# EAGLE design Pure Keys aec-pcb3-smd-inProgress (EAGLE 9.1.1)

## Sheet 1 of 7: ATMEGA328P
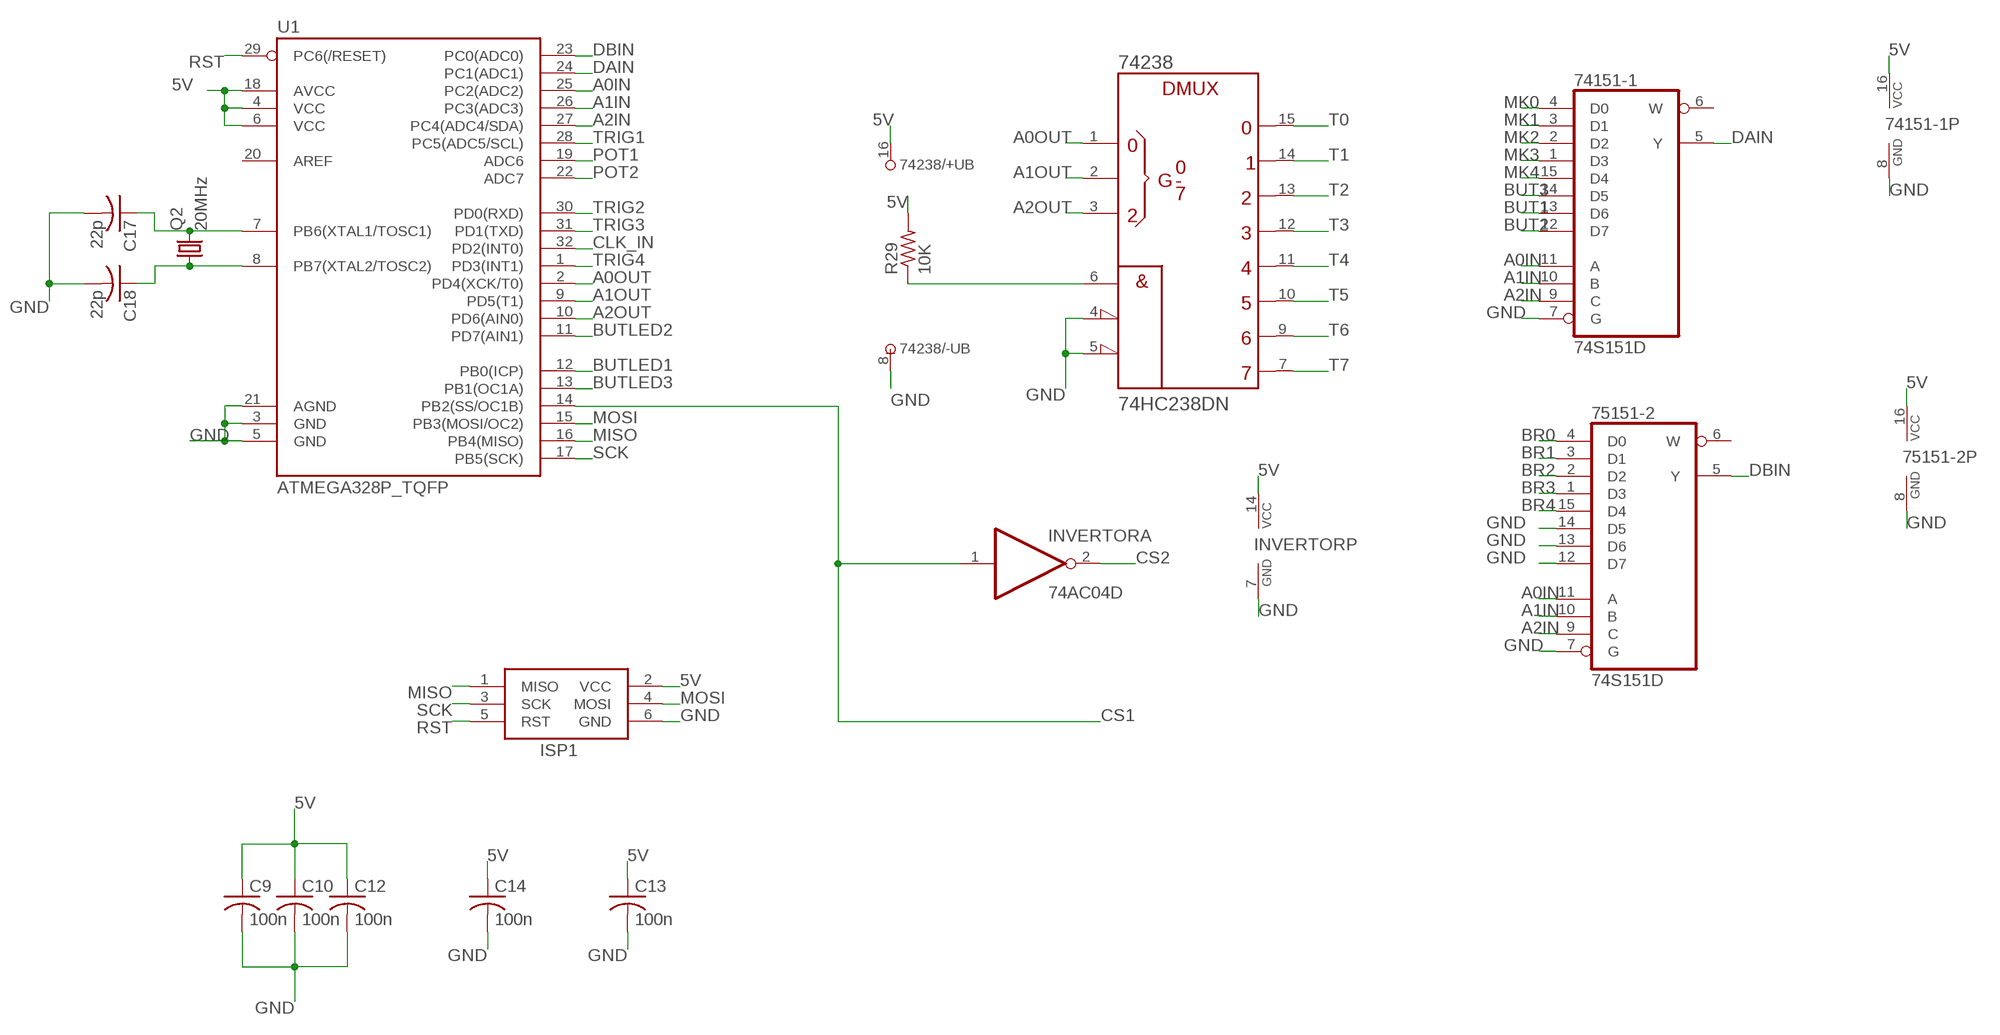
[diagram p0: schematic, sheet 1]

### Parts
74151-1  74S151D  [SO16]
74238  74HC238DN  [SO16]
75151-2  74S151D  [SO16]
C9  100n  C-USC0805K  [C0805K]
C10  100n  C-USC0805K  [C0805K]
C12  100n  C-USC0805K  [C0805K]
C13  100n  C-USC0805K  [C0805K]
C14  100n  C-USC0805K  [C0805K]
C17  22p  C-USC0805K  [C0805K]
C18  22p  C-USC0805K  [C0805K]
INVERTOR  74AC04D  [SO14]
ISP1  AVRISP-6  [AVRISP]
Q2  20MHz  CRYSTALHC49UP  [HC49UP]
R29  10K  R-US_R0805  [R0805]
U1  ATMEGA328P_TQFP  [TQFP32-08]

### Nets
5V: 74151-1.16(VCC) 74238.16(+UB) 75151-2.16(VCC) C9.1 C10.1 C12.1 C13.1 C14.1 INVERTOR.14(P:VCC) ISP1.2(VCC) R29.2 U1.4(VCC) U1.6(VCC) U1.18(AVCC) ; also sheet 2,4,5,6,7
A0IN: 74151-1.11(A) 75151-2.11(A) U1.25(PC2(ADC2))
A0OUT: 74238.1(A) U1.2(PD4(XCK/T0))
A1IN: 74151-1.10(B) 75151-2.10(B) U1.26(PC3(ADC3))
A1OUT: 74238.2(B) U1.9(PD5(T1))
A2IN: 74151-1.9(C) 75151-2.9(C) U1.27(PC4(ADC4/SDA))
A2OUT: 74238.3(C) U1.10(PD6(AIN0))
BR0: 75151-2.4(D0) ; also sheet 3
BR1: 75151-2.3(D1) ; also sheet 3
BR2: 75151-2.2(D2) ; also sheet 3
BR3: 75151-2.1(D3) ; also sheet 3
BR4: 75151-2.15(D4) ; also sheet 3
BUT1: 74151-1.13(D6) ; also sheet 6
BUT2: 74151-1.12(D7) ; also sheet 6
BUT3: 74151-1.14(D5) ; also sheet 6
BUTLED1: U1.12(PB0(ICP)) ; also sheet 6
BUTLED2: U1.11(PD7(AIN1)) ; also sheet 6
BUTLED3: U1.13(PB1(OC1A)) ; also sheet 6
CLK_IN: U1.32(PD2(INT0)) ; also sheet 7
CS1: INVERTOR.1(A:I) U1.14(PB2(SS/OC1B)) ; also sheet 5
CS2: INVERTOR.2(A:O) ; also sheet 5
DAIN: 74151-1.5(Y) U1.24(PC1(ADC1))
DBIN: 75151-2.5(Y) U1.23(PC0(ADC0))
ENOUT1: 74238.6(G1) R29.1
GND: 74151-1.7(G) 74151-1.8(GND) 74238.4(!G2A) 74238.5(!G2B) 74238.8(-UB) 75151-2.7(G) 75151-2.8(GND) 75151-2.12(D7) 75151-2.13(D6) 75151-2.14(D5) C9.2 C10.2 C12.2 C13.2 C14.2 C17.2 C18.2 INVERTOR.7(P:GND) ISP1.6(GND) U1.3(GND) U1.5(GND) U1.21(AGND) ; also sheet 2,3,4,5,6,7
MISO: ISP1.1(MISO) U1.16(PB4(MISO))
MK0: 74151-1.4(D0) ; also sheet 3
MK1: 74151-1.3(D1) ; also sheet 3
MK2: 74151-1.2(D2) ; also sheet 3
MK3: 74151-1.1(D3) ; also sheet 3
MK4: 74151-1.15(D4) ; also sheet 3
MOSI: ISP1.4(MOSI) U1.15(PB3(MOSI/OC2)) ; also sheet 5
N$10: C17.1 Q2.2 U1.7(PB6(XTAL1/TOSC1))
N$11: C18.1 Q2.1 U1.8(PB7(XTAL2/TOSC2))
POT1: U1.19(ADC6) ; also sheet 6
POT2: U1.22(ADC7) ; also sheet 6
RST: ISP1.5(RST) U1.29(PC6(/RESET))
SCK: ISP1.3(SCK) U1.17(PB5(SCK)) ; also sheet 5
T0: 74238.15(Y0) ; also sheet 3
T1: 74238.14(Y1) ; also sheet 3
T2: 74238.13(Y2) ; also sheet 3
T3: 74238.12(Y3) ; also sheet 3
T4: 74238.11(Y4) ; also sheet 3
T5: 74238.10(Y5) ; also sheet 3
T6: 74238.9(Y6) ; also sheet 3
T7: 74238.7(Y7) ; also sheet 3
TRIG1: U1.28(PC5(ADC5/SCL)) ; also sheet 4
TRIG2: U1.30(PD0(RXD)) ; also sheet 4
TRIG3: U1.31(PD1(TXD)) ; also sheet 4
TRIG4: U1.1(PD3(INT1)) ; also sheet 4
Unconnected: 74151-1.6(W) 75151-2.6(W) INVERTOR.3(B:I) INVERTOR.4(B:O) INVERTOR.5(C:I) INVERTOR.6(C:O) INVERTOR.8(D:O) INVERTOR.9(D:I) INVERTOR.10(E:O) INVERTOR.11(E:I) INVERTOR.12(F:O) INVERTOR.13(F:I) U1.20(AREF)

## Sheet 2 of 7: Power
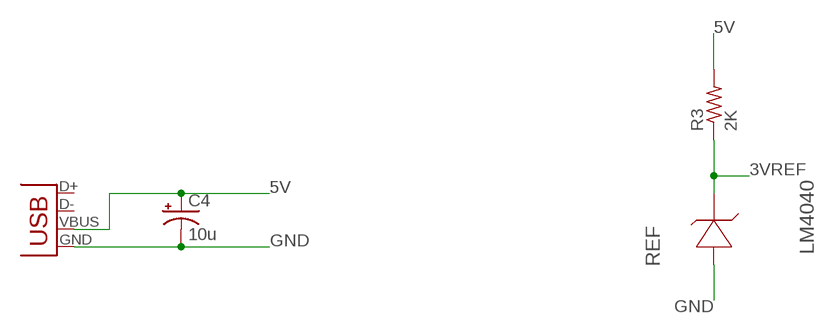
[diagram p1: schematic, sheet 2]

### Parts
C4  10u  CPOL-US153CLV-0505  [153CLV-0505]
JP2  USB-B  USBPTH  [USB-B-PTH]
R3  2K  R-US_R0805  [R0805]
REF  LM4040  LM4040A30IDBZT  [SOT95P237X112-3N]

### Nets
3VREF: R3.1 REF.1(CATHODE) ; also sheet 5
5V: C4.+ JP2.VBUS R3.2 ; also sheet 1,4,5,6,7
GND: C4.- JP2.GND REF.2(ANODE) ; also sheet 1,3,4,5,6,7
Unconnected: JP2.D+ JP2.D- REF.3(NC)

## Sheet 3 of 7: Keyboard Connector
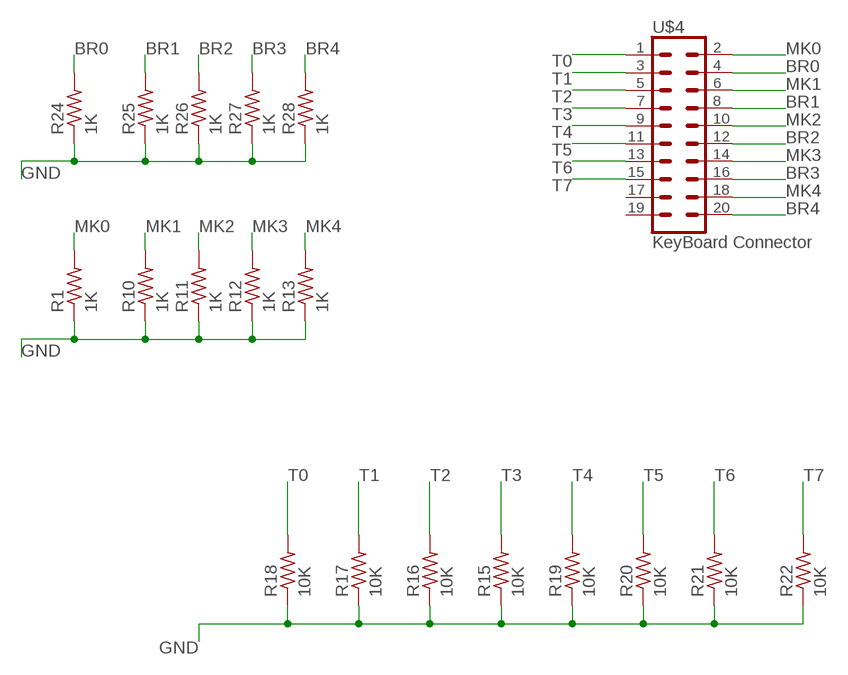
[diagram p2: schematic, sheet 3]

### Parts
R1  1K  R-US_R0805  [R0805]
R10  1K  R-US_R0805  [R0805]
R11  1K  R-US_R0805  [R0805]
R12  1K  R-US_R0805  [R0805]
R13  1K  R-US_R0805  [R0805]
R15  10K  R-US_R0805  [R0805]
R16  10K  R-US_R0805  [R0805]
R17  10K  R-US_R0805  [R0805]
R18  10K  R-US_R0805  [R0805]
R19  10K  R-US_R0805  [R0805]
R20  10K  R-US_R0805  [R0805]
R21  10K  R-US_R0805  [R0805]
R22  10K  R-US_R0805  [R0805]
R24  1K  R-US_R0805  [R0805]
R25  1K  R-US_R0805  [R0805]
R26  1K  R-US_R0805  [R0805]
R27  1K  R-US_R0805  [R0805]
R28  1K  R-US_R0805  [R0805]
U$4  KeyBoard Connector  CONN_10X2  [2X10]

### Nets
BR0: R24.2 U$4.4 ; also sheet 1
BR1: R25.2 U$4.8 ; also sheet 1
BR2: R26.2 U$4.12 ; also sheet 1
BR3: R27.2 U$4.16 ; also sheet 1
BR4: R28.2 U$4.20 ; also sheet 1
GND: R1.1 R10.1 R11.1 R12.1 R13.1 R15.1 R16.1 R17.1 R18.1 R19.1 R20.1 R21.1 R22.1 R24.1 R25.1 R26.1 R27.1 R28.1 ; also sheet 1,2,4,5,6,7
MK0: R1.2 U$4.2 ; also sheet 1
MK1: R10.2 U$4.6 ; also sheet 1
MK2: R11.2 U$4.10 ; also sheet 1
MK3: R12.2 U$4.14 ; also sheet 1
MK4: R13.2 U$4.18 ; also sheet 1
T0: R18.2 U$4.1 ; also sheet 1
T1: R17.2 U$4.3 ; also sheet 1
T2: R16.2 U$4.5 ; also sheet 1
T3: R15.2 U$4.7 ; also sheet 1
T4: R19.2 U$4.9 ; also sheet 1
T5: R20.2 U$4.11 ; also sheet 1
T6: R21.2 U$4.13 ; also sheet 1
T7: R22.2 U$4.15 ; also sheet 1
Unconnected: U$4.17 U$4.19

## Sheet 4 of 7: Triggers
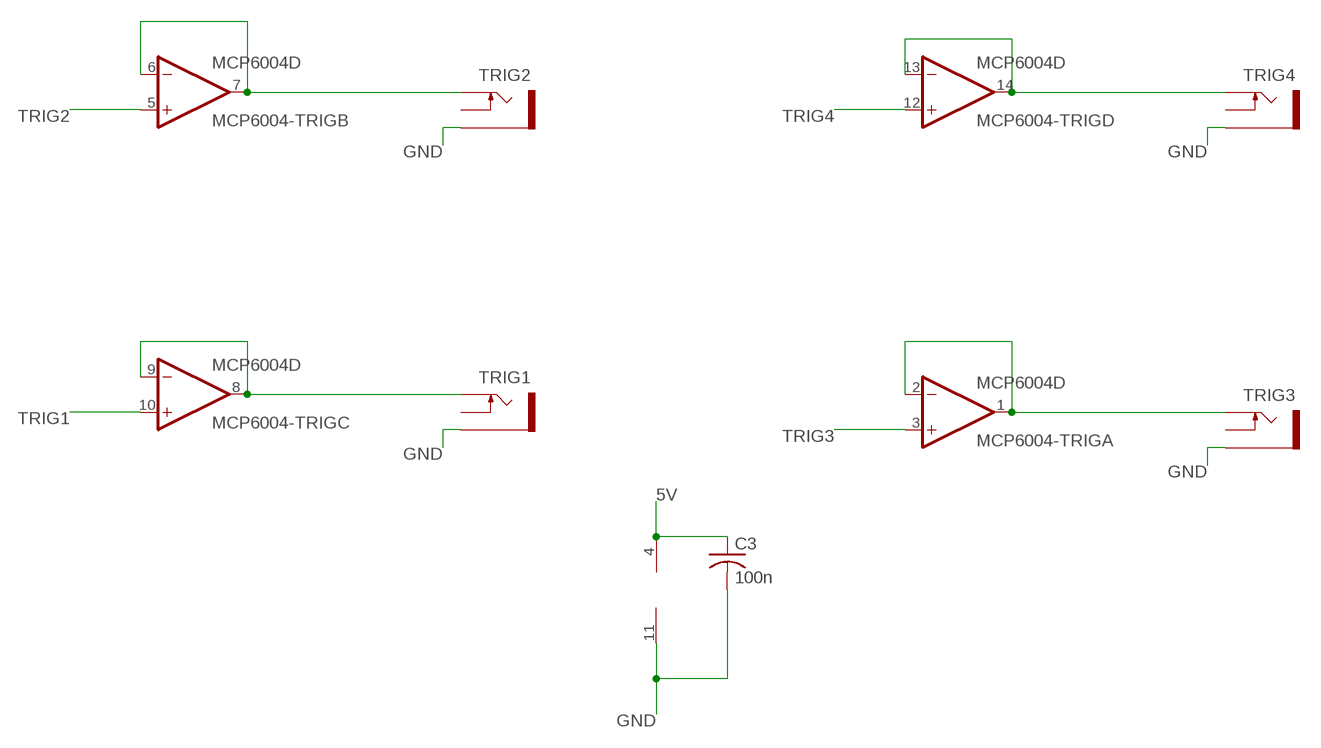
[diagram p3: schematic, sheet 4]

### Parts
C3  100n  C-USC0805K  [C0805K]
MCP6004-TRIG  MCP6004D  [SO14]
TRIG1  PJ302M  [PJ302M]
TRIG2  PJ302M  [PJ302M]
TRIG3  PJ302M  [PJ302M]
TRIG4  PJ302M  [PJ302M]

### Nets
5V: C3.1 MCP6004-TRIG.4(P:V+) ; also sheet 1,2,5,6,7
GND: C3.2 MCP6004-TRIG.11(P:V-) TRIG1.GND(SLEEVE) TRIG2.GND(SLEEVE) TRIG3.GND(SLEEVE) TRIG4.GND(SLEEVE) ; also sheet 1,2,3,5,6,7
N$3: MCP6004-TRIG.6(B:-IN) MCP6004-TRIG.7(B:OUT) TRIG2.TIP
N$4: MCP6004-TRIG.8(C:OUT) MCP6004-TRIG.9(C:-IN) TRIG1.TIP
N$5: MCP6004-TRIG.13(D:-IN) MCP6004-TRIG.14(D:OUT) TRIG4.TIP
N$6: MCP6004-TRIG.1(A:OUT) MCP6004-TRIG.2(A:-IN) TRIG3.TIP
TRIG1: MCP6004-TRIG.10(C:+IN) ; also sheet 1
TRIG2: MCP6004-TRIG.5(B:+IN) ; also sheet 1
TRIG3: MCP6004-TRIG.3(A:+IN) ; also sheet 1
TRIG4: MCP6004-TRIG.12(D:+IN) ; also sheet 1
Unconnected: TRIG1.SW(SWITCH) TRIG2.SW(SWITCH) TRIG3.SW(SWITCH) TRIG4.SW(SWITCH)

## Sheet 5 of 7: CV Out
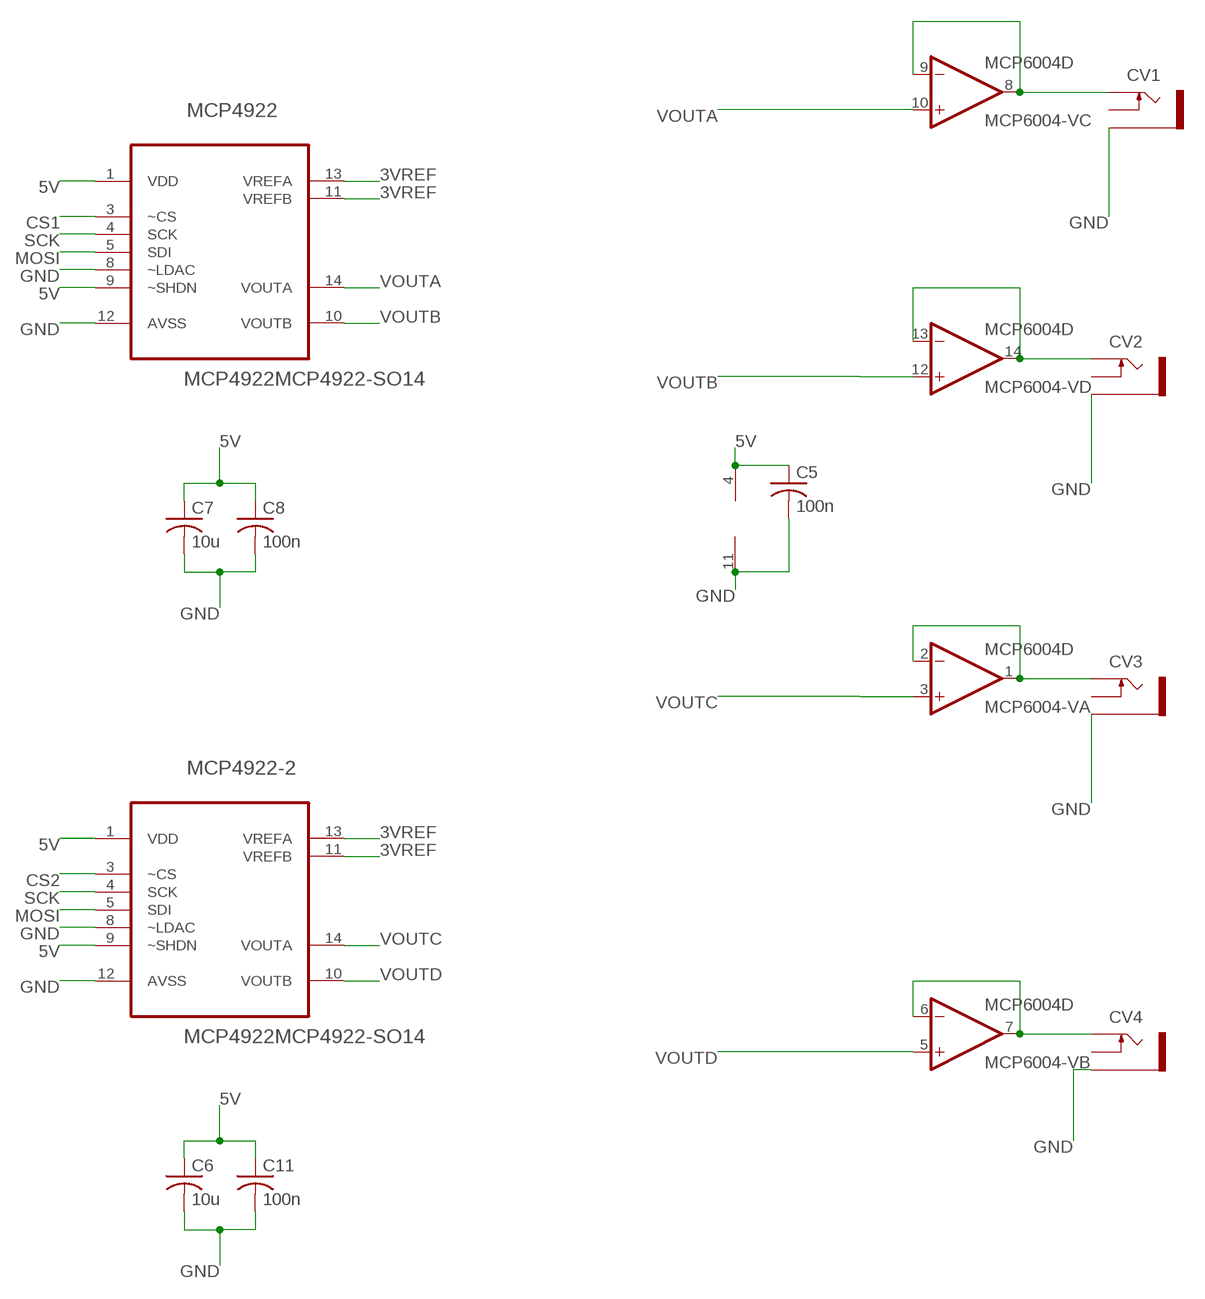
[diagram p4: schematic, sheet 5]

### Parts
C5  100n  C-USC0805K  [C0805K]
C6  10u  C-USC0805K  [C0805K]
C7  10u  C-USC0805K  [C0805K]
C8  100n  C-USC0805K  [C0805K]
C11  100n  C-USC0805K  [C0805K]
CV1  PJ302M  [PJ302M]
CV2  PJ302M  [PJ302M]
CV3  PJ302M  [PJ302M]
CV4  PJ302M  [PJ302M]
MCP4922  MCP4922MCP4922-SO14  [SO14]
MCP4922-2  MCP4922MCP4922-SO14  [SO14]
MCP6004-V  MCP6004D  [SO14]

### Nets
3VREF: MCP4922-2.11(VREFB) MCP4922-2.13(VREFA) MCP4922.11(VREFB) MCP4922.13(VREFA) ; also sheet 2
5V: C5.1 C6.1 C7.1 C8.1 C11.1 MCP4922-2.1(VDD) MCP4922-2.9(~SHDN) MCP4922.1(VDD) MCP4922.9(~SHDN) MCP6004-V.4(P:V+) ; also sheet 1,2,4,6,7
CS1: MCP4922.3(~CS) ; also sheet 1
CS2: MCP4922-2.3(~CS) ; also sheet 1
GND: C5.2 C6.2 C7.2 C8.2 C11.2 CV1.GND(SLEEVE) CV2.GND(SLEEVE) CV3.GND(SLEEVE) CV4.GND(SLEEVE) MCP4922-2.8(~LDAC) MCP4922-2.12(AVSS) MCP4922.8(~LDAC) MCP4922.12(AVSS) MCP6004-V.11(P:V-) ; also sheet 1,2,3,4,6,7
MOSI: MCP4922-2.5(SDI) MCP4922.5(SDI) ; also sheet 1
N$7: CV1.TIP MCP6004-V.8(C:OUT) MCP6004-V.9(C:-IN)
N$25: CV4.TIP MCP6004-V.6(B:-IN) MCP6004-V.7(B:OUT)
N$31: CV3.TIP MCP6004-V.1(A:OUT) MCP6004-V.2(A:-IN)
N$36: CV2.TIP MCP6004-V.13(D:-IN) MCP6004-V.14(D:OUT)
SCK: MCP4922-2.4(SCK) MCP4922.4(SCK) ; also sheet 1
VOUTA: MCP4922.14(VOUTA) MCP6004-V.10(C:+IN)
VOUTB: MCP4922.10(VOUTB) MCP6004-V.12(D:+IN)
VOUTC: MCP4922-2.14(VOUTA) MCP6004-V.3(A:+IN)
VOUTD: MCP4922-2.10(VOUTB) MCP6004-V.5(B:+IN)
Unconnected: CV1.SW(SWITCH) CV2.SW(SWITCH) CV3.SW(SWITCH) CV4.SW(SWITCH)

## Sheet 6 of 7: Pots and Buttons
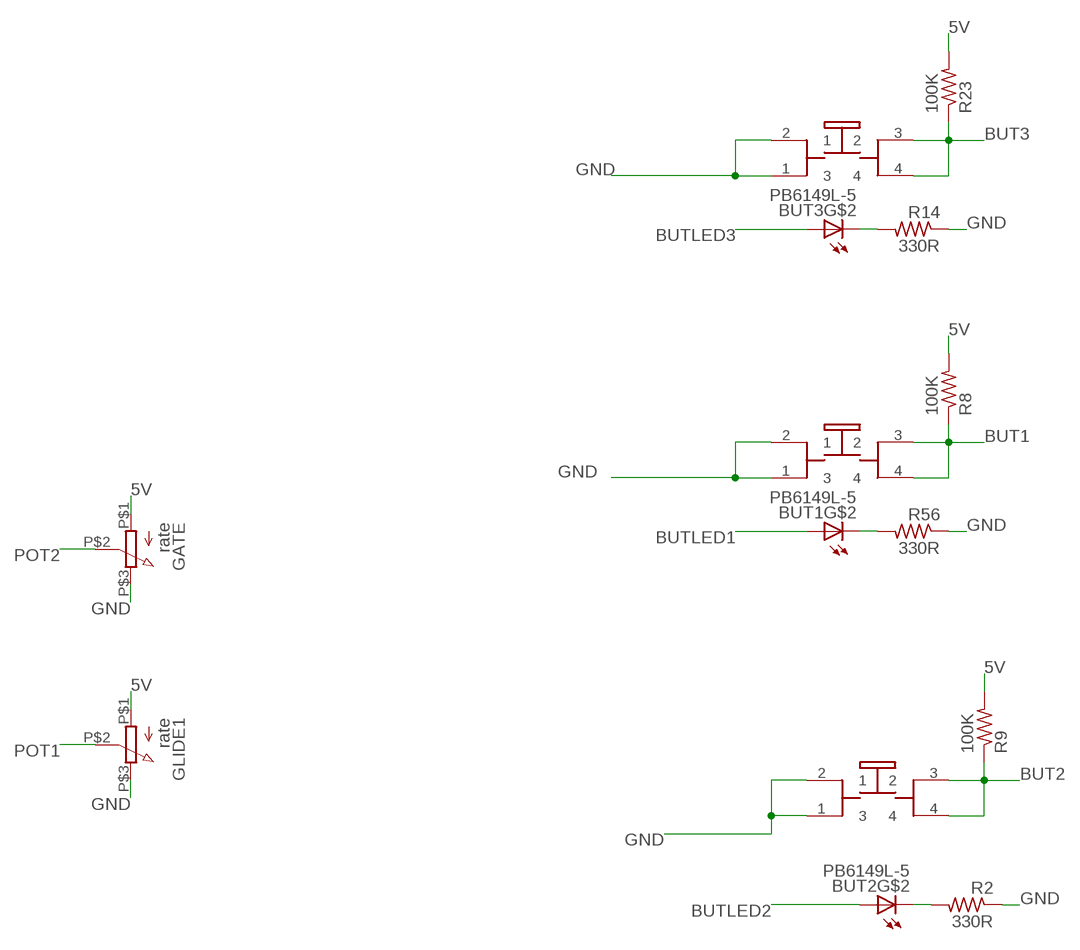
[diagram p5: schematic, sheet 6]

### Parts
BUT1  PB6149L-5  [PB6149L]
BUT2  PB6149L-5  [PB6149L]
BUT3  PB6149L-5  [PB6149L]
GATE  rate  9MMPOT  [POT]
GLIDE1  rate  9MMPOT  [POT]
R2  330R  R-US_R0805  [R0805]
R8  100K  R-US_R0805  [R0805]
R9  100K  R-US_R0805  [R0805]
R14  330R  R-US_R0805  [R0805]
R23  100K  R-US_R0805  [R0805]
R56  330R  R-US_R0805  [R0805]

### Nets
5V: GATE.P$1 GLIDE1.P$1 R8.2 R9.2 R23.2 ; also sheet 1,2,4,5,7
BUT1: BUT1.3 BUT1.4 R8.1 ; also sheet 1
BUT2: BUT2.3 BUT2.4 R9.1 ; also sheet 1
BUT3: BUT3.3 BUT3.4 R23.1 ; also sheet 1
BUTLED1: BUT1.A ; also sheet 1
BUTLED2: BUT2.A ; also sheet 1
BUTLED3: BUT3.A ; also sheet 1
GND: BUT1.1 BUT1.2 BUT2.1 BUT2.2 BUT3.1 BUT3.2 GATE.P$3 GLIDE1.P$3 R2.1 R14.1 R56.1 ; also sheet 1,2,3,4,5,7
N$1: BUT3.K(C) R14.2
N$8: BUT2.K(C) R2.2
N$65: BUT1.K(C) R56.2
POT1: GLIDE1.P$2 ; also sheet 1
POT2: GATE.P$2 ; also sheet 1

## Sheet 7 of 7: Clock
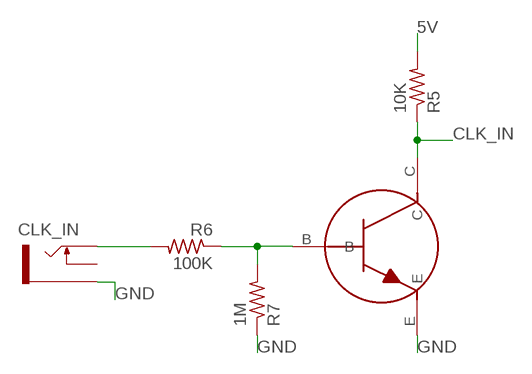
[diagram p6: schematic, sheet 7]

### Parts
CLK_IN  PJ302M  [PJ302M]
CLOCK  2N3904  TRANSISTOR_MMBT3904  [TRANSISTOR_SINGLE_N-TYPE]
R5  10K  R-US_R0805  [R0805]
R6  100K  R-US_R0805  [R0805]
R7  1M  R-US_R0805  [R0805]

### Nets
5V: R5.2 ; also sheet 1,2,4,5,6
CLK_IN: CLOCK.C R5.1 ; also sheet 1
GND: CLK_IN.GND(SLEEVE) CLOCK.E R7.1 ; also sheet 1,2,3,4,5,6
N$17: CLOCK.B R6.1 R7.2
N$26: CLK_IN.TIP R6.2
Unconnected: CLK_IN.SW(SWITCH)

## Library data of the parts
74151-1 75151-2 = 74xx-eu:74*151: Data SELECTOR/MULTIPLEXER
74238 = GMSN-R2Project:74HC238D: 1 of 8 noninverting DECODER/DEMULTIPLEXER
BUT1-BUT3 = INSTRUO:PB6149L-5
C3 C5-C14 C17 C18 = rcl:C-US: CAPACITOR, American symbol
C4 = rcl:CPOL-US: POLARIZED CAPACITOR, American symbol
CLK_IN CV1-CV4 TRIG1-TRIG4 = GMSN:PJ302M: PJ302M horizontal / right angled mount 3.5 mm jack socket
CLOCK = INSTRUO:TRANSISTOR_MMBT3904
GATE GLIDE1 = GMSN:9MMPOT
INVERTOR = 74xx-eu:74*04: Hex INVERTER
ISP1 = adafruit:AVRISP: AVR ISP HEADER Standard 6 pin header for AVR programming
JP2 = SparkFun-Connectors:USB: USB Connectors USB-B-PTH is fully proven SKU : PRT-00139/CONN-08278 USB-miniB is fully proven SKU : PRT-00587 USB-A-PCB is untested. USB-A-H is throughly reviewed, but untested. Spark Fun Electronics SKU : PRT-00437 USB-B-SMT is throughly reviewed, but untested. Needs silkscreen touching up. USB-A-S has not been used/tested USB-MB-H has not been used/tested USB-MICROB has been used. CONN-09505; PROD_ID: CONN-08278
MCP4922 MCP4922-2 = GMSN-R2Project:MCP4922
MCP6004-TRIG MCP6004-V = GMSN-R2Project:MCP6004: OP AMP
Q2 = adafruit:CRYSTAL: CRYSTAL; OC_FARNELL: unknown; OC_NEWARK: unknown
R1 R10-R13 R24-R28 = rcl:R-US_: RESISTOR, American symbol; RS-PART: 223-0427
R2 R3 R5-R9 R14-R23 R29 R56 = rcl:R-US_: RESISTOR, American symbol
REF = GMSN-R2Project:LM4040A30IDBZT: PRECISION MICROPOWER SHUNT VOLTAGE REFERENCE; MPN: LM4040A30IDBZT; OC_FARNELL: 1755108; OC_NEWARK: 58K5870; PACKAGE: 3-SOT-23; RS-PART: 809-6343; SUPPLIER: TEXAS INSTRUMENTS
U1 = SparkFun-IC-Microcontroller:ATMEGA328P_TQFP: Popular 328P in QFP Storefront component: ATmega328 - TQFP <https://www.sparkfun.com/products/13448> (COM-13448) Datasheet <http://www.sparkfun.com/datasheets/Components/SMD/ATMega328.pdf> SparkFun Products SparkFun RedBoard - Programmed with Arduino <https://www.sparkfun.com/products/12757> (DEV-12757) Arduino Pro Mini 328 - 5V/16MHz <https://www.sparkfun.com/products/11113> (DEV-11113) Arduino Pro Mini 328 - 3.3V/8MHz <https://www.sparkfun.com/products/11114> (DEV-11114) SparkFun OpenLog <https://www.sparkfun.com/products/13712> (DEV-13712) SparkFun MicroView - OLED Arduino Module <https://www.sparkfun.com/products/12923> (DEV-12923) SparkFun Digital Sandbox <https://www.sparkfun.com/products/12651> (DEV-12651) SparkFun PicoBoard <https://www.sparkfun.com/products/11888> (WIG-11888) Arduino Fio <https://www.sparkfun.com/products/10116> (DEV-10116) LilyPad Arduino 328 Main Board <https://www.sparkfun.com/products/13342> (DEV-13342) SparkFun RedStick <https://www.sparkfun.com/products/13741> (DEV-13741) LilyPad MP3 <https://www.sparkfun.com/products/11013> (DEV-11013) LilyPad Arduino SimpleSnap <https://www.sparkfun.com/products/10941> (DEV-10941) SparkFun Stepoko <https://www.sparkfun.com/products/13899> (ROB-13899) SparkFun Geiger Counter <https://www.sparkfun.com/products/11345> (SEN-11345) SparkFun EL Sequencer <https://www.sparkfun.com/products/12781> (COM-12781) Arduino Pro 328 - 5V/16MHz <https://www.sparkfun.com/products/10915> (DEV-10915) CryptoCape <https://www.sparkfun.com/products/12773> (DEV-12773) SparkFun IR Thermometer Evaluation Board - MLX90614 <https://www.sparkfun.com/products/10740> (SEN-10740) SparkFun RedBot Mainboard <https://www.sparkfun.com/products/12097> (ROB-12097) Arduino Pro 328 - 3.3V/8MHz <https://www.sparkfun.com/products/10914> (DEV-10914) SparkFun Block for Intel® Edison - Arduino <https://www.sparkfun.com/products/13036> (DEV-13036) SparkFun Simon Says - Surface Mount Soldering Kit <https://www.sparkfun.com/products/10935> (KIT-10935) SparkFun 7-Segment Serial Display - Red <https://www.sparkfun.com/products/11441> (COM-11441) SparkFun 7-Segment Serial Display - White <https://www.sparkfun.com/products/11629> (COM-11629) SparkFun 7-Segment Serial Display - Yellow <https://www.sparkfun.com/products/11443> (COM-11443) SparkFun 7-Segment Serial Display - Kelly Green <https://www.sparkfun.com/products/11440> (COM-11440) SparkFun 7-Segment Serial Display - Blue <https://www.sparkfun.com/products/11442> (COM-11442) SparkFun OpenSegment Serial Display - 20mm (Blue) <https://www.sparkfun.com/products/11647> (COM-11647) SparkFun OpenSegment Serial Display - 20mm (Green) <https://www.sparkfun.com/products/11646> (COM-11646) SparkFun OpenSegment Serial Display - 20mm (White) <https://www.sparkfun.com/products/11648> (COM-11648) SparkFun OpenSegment Serial Display - 20mm (Red) <https://www.sparkfun.com/products/11644> (COM-11644) SparkFun OpenSegment Serial Display - 20mm (Yellow) <https://www.sparkfun.com/products/11645> (COM-11645) SparkFun OpenSegment Shield <https://www.sparkfun.com/products/13190> (DEV-13190); PROD_ID: IC-09069
U$4 = SparkFun-Connectors:CONN_10X2: Multi connection point. Often used as Generic Header-pin footprint for 0.1 inch spaced/style header connections On any of the 0.1 inch spaced packages, you can populate with these: Break Away Headers - Straight <https://www.sparkfun.com/products/116> (PRT-00116) Break Away Male Headers - Right Angle <https://www.sparkfun.com/products/553> (PRT-00553) Female Headers <https://www.sparkfun.com/products/115> (PRT-00115) Break Away Headers - Machine Pin <https://www.sparkfun.com/products/117> (PRT-00117) Break Away Female Headers - Swiss Machine Pin <https://www.sparkfun.com/products/743> (PRT-00743); RS-PART: 669-5364

## Net classes
1 Power: width 0.8 mm

## Board
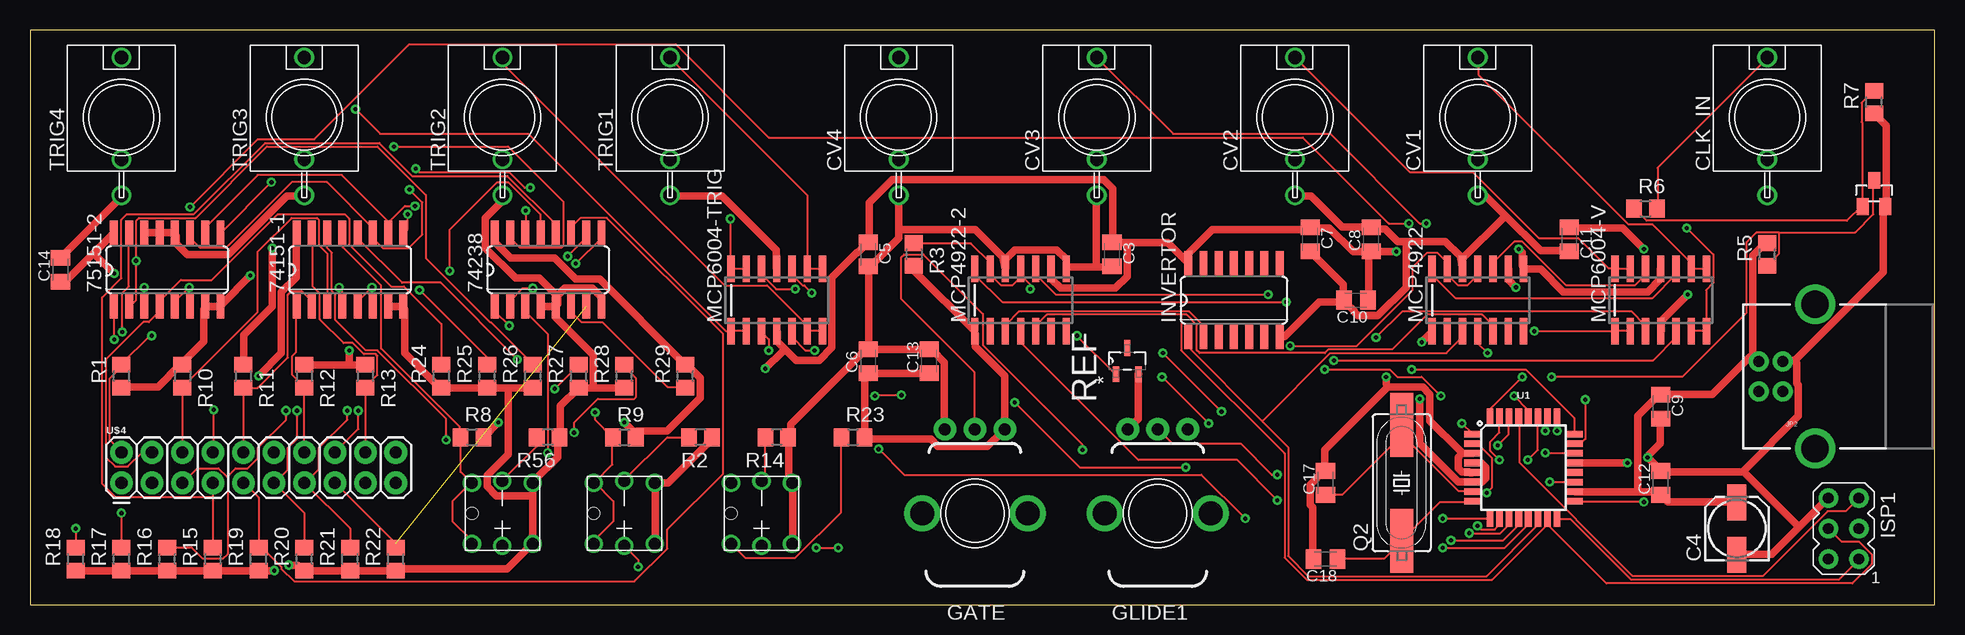
[diagram p7: board, top side]
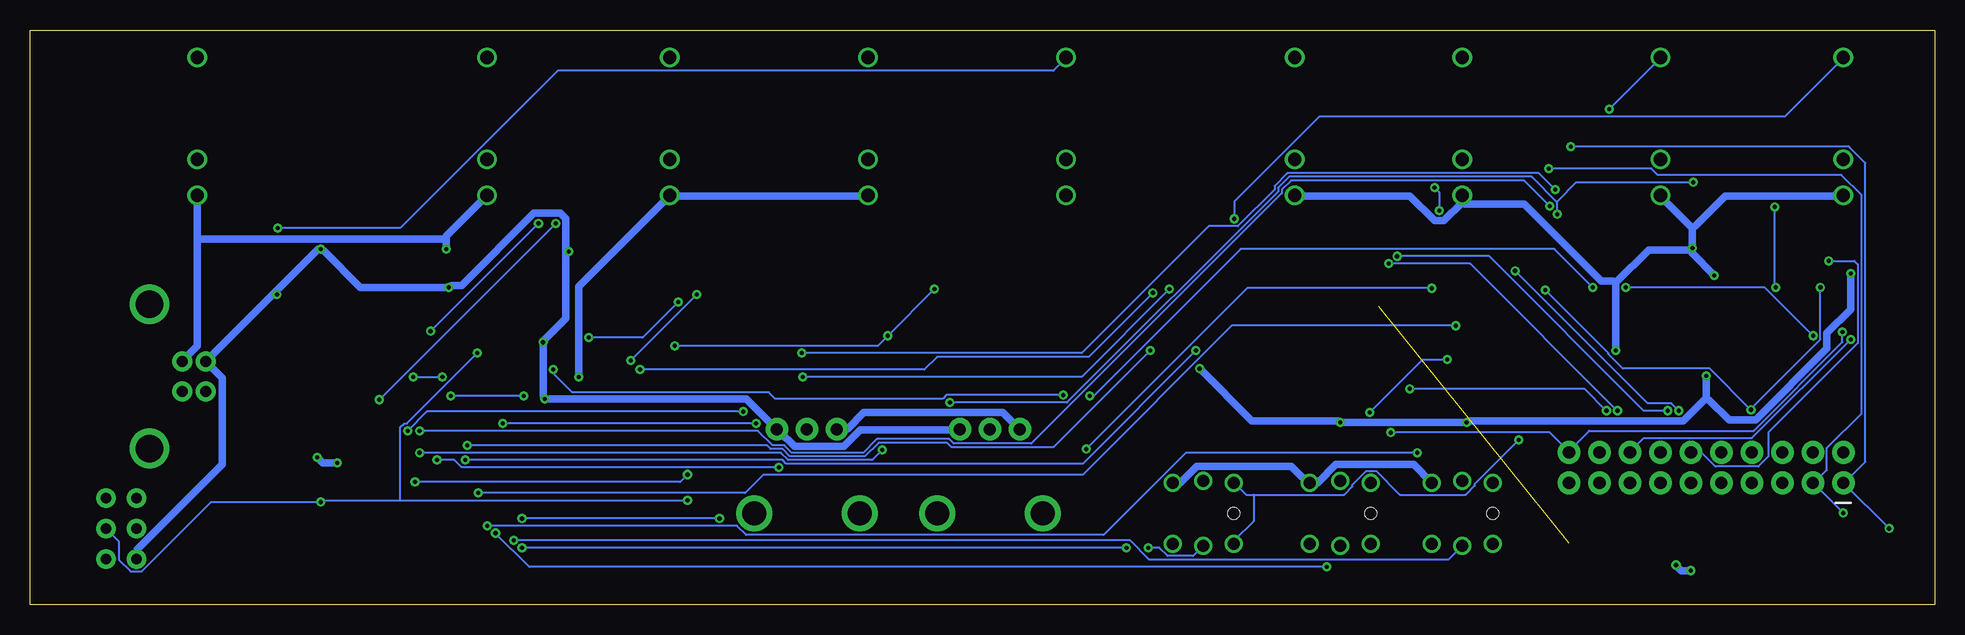
[diagram p8: board, bottom side, seen from below]

Size 158.73 x 47.93 mm. Coordinates in mm from the lower left corner, seen from the top.
Outline: 0,0 158.73,0 158.73,47.93 0,47.93 0,0
Copper layers (1*16): Top 0.035mm / dielectric 1.5mm / Bottom 0.035mm
Design rules "default": minimum track width 6mil, minimum drill 0.35mm, track to track 6mil, track to pad 6mil, pad to pad 6mil, via to via 6mil, smd to smd 6mil, copper to edge 40mil, drill to drill 6mil, minimum pad ring 10mil, minimum via ring 8mil, stop-mask expansion 4mil, vias tented up to drill 0mil, thermal gap 10mil

### Footprints (pad centres in the part's own frame; a part is rotated, then mirrored left to right if it is on the bottom)
SO16 = smd 0.66 x 2.032: 1 -4.445,-3.073; 2 -3.175,-3.073; 3 -1.905,-3.073; 4 -0.635,-3.073; 5 0.635,-3.073; 6 1.905,-3.073; 7 3.175,-3.073; 8 4.445,-3.073; 9 4.445,3.073; 10 3.175,3.073; 11 1.905,3.073; 12 0.635,3.073; 13 -0.635,3.073; 14 -1.905,3.073; 15 -3.175,3.073; 16 -4.445,3.073
PB6149L = drill 1: 1 2.54,-2.54; 2 2.54,2.54; 3 -2.54,-2.54; 4 -2.54,2.54; A 0,-2.7; K 0,2.7 | hole 1: -2.54,0
C0805K = smd 1.3 x 1.6: 1 -1,0; 2 1,0
153CLV-0505 = smd 3 x 1.6: + 2.2,0; - -2.2,0
S_JACK = drill 1.1: GND 0,-6.5; NORM 0,-3.5; TIP 0,5
TRANSISTOR_SINGLE_N-TYPE = smd 1 x 1.4: B -0.95,-1.1; C 0,1.1; E 0.95,-1.1
POT = drill 1 pad 1.88: P$1 -2.5,-7; P$2 0,-7; P$3 2.5,-7 | drill 2 pad 2.68: P$4 -4.4,0; P$5 4.4,0
SO14 = smd 0.66 x 2.032: 1 -3.81,-3.073; 2 -2.54,-3.073; 3 -1.27,-3.073; 4 0,-3.073; 5 1.27,-3.073; 6 2.54,-3.073; 7 3.81,-3.073; 8 3.81,3.073; 9 2.54,3.073; 10 1.27,3.073; 11 0,3.073; 12 -1.27,3.073; 13 -2.54,3.073; 14 -3.81,3.073
AVRISP = drill 0.9 pad 1.626: 1 -1.27,2.54; 2 1.27,2.54; 3 -1.27,0; 4 1.27,0; 5 -1.27,-2.54; 6 1.27,-2.54
USB-B-PTH = drill 0.914 pad 1.676: D+ 0,1.25; D- 1.981,1.25; GND 0,-1.25; VBUS 1.981,-1.25 | drill 2.286: S1 -2.718,-6.02; S2 -2.718,6.02
SO14' = smd 0.6 x 2.2: 1 -3.81,-2.6; 2 -2.54,-2.6; 3 -1.27,-2.6; 4 0,-2.6; 5 1.27,-2.6; 6 2.54,-2.6; 7 3.81,-2.6; 8 3.81,2.6; 9 2.54,2.6; 10 1.27,2.6; 11 0,2.6; 12 -1.27,2.6; 13 -2.54,2.6; 14 -3.81,2.6
HC49UP = smd 5.334 x 1.93: 1 -4.826,0; 2 4.826,0
R0805 = smd 1.3 x 1.5: 1 -0.95,0; 2 0.95,0
SOT95P237X112-3N = smd 1.321 x 0.559: 1 -1.092,0.94; 2 -1.092,-0.94 | smd 1.321 x 0.508: 3 1.092,0
TQFP32-08 = smd 1.27 x 0.559: 1 -4.293,2.8; 2 -4.293,2; 3 -4.293,1.2; 4 -4.293,0.4; 5 -4.293,-0.4; 6 -4.293,-1.2; 7 -4.293,-2; 8 -4.293,-2.8; 17 4.293,-2.8; 18 4.293,-2; 19 4.293,-1.2; 20 4.293,-0.4; 21 4.293,0.4; 22 4.293,1.2; 23 4.293,2; 24 4.293,2.8 | smd 0.559 x 1.27: 9 -2.8,-4.293; 10 -2,-4.293; 11 -1.2,-4.293; 12 -0.4,-4.293; 13 0.4,-4.293; 14 1.2,-4.293; 15 2,-4.293; 16 2.8,-4.293; 25 2.8,4.293; 26 2,4.293; 27 1.2,4.293; 28 0.4,4.293; 29 -0.4,4.293; 30 -1.2,4.293; 31 -2,4.293; 32 -2.8,4.293
2X10 = drill 1.016 pad 1.88: 1 0,0; 2 0,2.54; 3 2.54,0; 4 2.54,2.54; 5 5.08,0; 6 5.08,2.54; 7 7.62,0; 8 7.62,2.54; 9 10.16,0; 10 10.16,2.54; 11 12.7,0; 12 12.7,2.54; 13 15.24,0; 14 15.24,2.54; 15 17.78,0; 16 17.78,2.54; 17 20.32,0; 18 20.32,2.54; 19 22.86,0; 20 22.86,2.54

### Placement (x,y rotation side)
74151-1  26.67,27.94 0 top
74238  43.18,27.94 0 top
75151-2  11.43,27.94 0 top
BUT1  39.37,7.62 0 top
BUT2  49.53,7.62 0 top
BUT3  60.96,7.62 0 top
C3  90.17,29.21 270 top
C4  142.24,6.35 90 top
C5  69.85,29.21 270 top
C6  69.85,20.32 90 top
C7  106.68,30.48 270 top
C8  111.76,30.48 90 top
C9  135.89,16.51 270 top
C10  110.49,25.4 180 top
C11  128.27,30.48 270 top
C12  135.89,10.16 90 top
C13  74.93,20.32 90 top
C14  2.54,27.94 90 top
C17  107.95,10.16 90 top
C18  107.95,3.81 180 top
CLK_IN  S_JACK  [S_JACK]  144.78,40.64 0 top
CLOCK  153.67,34.29 0 top
CV1  S_JACK  [S_JACK]  120.65,40.64 0 top
CV2  S_JACK  [S_JACK]  105.41,40.64 0 top
CV3  S_JACK  [S_JACK]  88.9,40.64 0 top
CV4  S_JACK  [S_JACK]  72.39,40.64 0 top
GATE  78.74,7.62 180 top
GLIDE1  93.98,7.62 180 top
INVERTOR  100.33,25.4 0 top
ISP1  151.13,6.35 180 top
JP2  146.05,19.05 180 top
MCP4922  MCP4922MCP4922-SO14  [SO14']  120.65,25.4 0 top
MCP4922-2  MCP4922MCP4922-SO14  [SO14']  82.55,25.4 0 top
MCP6004-TRIG  MCP6004D  [SO14']  62.23,25.4 0 top
MCP6004-V  MCP6004D  [SO14']  135.89,25.4 0 top
Q2  114.3,10.16 90 top
R1  7.62,19.05 90 top
R2  55.88,13.97 180 top
R3  73.66,29.21 270 top
R5  144.78,29.21 90 top
R6  134.62,33.02 0 top
R7  153.67,41.91 90 top
R8  36.83,13.97 0 top
R9  49.53,13.97 0 top
R10  12.7,19.05 270 top
R11  17.78,19.05 270 top
R12  22.86,19.05 270 top
R13  27.94,19.05 270 top
R14  62.23,13.97 180 top
R15  15.24,3.81 90 top
R16  11.43,3.81 90 top
R17  7.62,3.81 90 top
R18  3.81,3.81 90 top
R19  19.05,3.81 90 top
R20  22.86,3.81 90 top
R21  26.67,3.81 90 top
R22  30.48,3.81 90 top
R23  68.58,13.97 0 top
R24  34.29,19.05 90 top
R25  38.1,19.05 90 top
R26  41.91,19.05 90 top
R27  45.72,19.05 90 top
R28  49.53,19.05 90 top
R29  54.61,19.05 90 top
R56  43.18,13.97 180 top
REF  91.44,20.32 90 top
TRIG1  S_JACK  [S_JACK]  53.34,40.64 0 top
TRIG2  S_JACK  [S_JACK]  39.37,40.64 0 top
TRIG3  S_JACK  [S_JACK]  22.86,40.64 0 top
TRIG4  S_JACK  [S_JACK]  7.62,40.64 0 top
U1  124.46,11.43 0 top
U$4  7.62,10.16 0 top

### Tracks (layer width: path | path; a pad name or v marks a point on that pad's centre or on a via)
3VREF  (via drill 0.35)
  Top 0.152: R3.1 73.69,30.12 78.41,30.12 80.01,28.52 80.01,28.07 MCP4922-2.13 80.01,27.53 80.92,26.62 81.84,26.62 82.6,27.38 MCP4922-2.11 82.6,27.99 82.6,27.46 83.36,26.7 v83.36,26.31 | MCP4922.11 120.62,27.99 120.62,27.46 119.79,26.62 119.02,26.62 118.11,27.53 MCP4922.13 118.11,28.07 118.11,28.52 117.27,29.36 116.43,29.36 115.21,28.14 115.21,26.24 110.57,21.59 v105,21.59 | v87.25,22.43 90.45,19.23 REF.1
  Bottom 0.152: v83.36,26.31 v87.25,22.43 88.09,21.59 v105,21.59
5V  (via drill 0.35)
  Top 0.61: 5.3,29.32 6.93,30.96 75151-2.16 | 5.3,29.32 2.97,27 2.59,27 C14.1 | v39.01,15.19 37.8,13.97 R8.2 | v49.53,15.19 50.44,14.27 50.44,13.97 R9.2 50.6,14.5 53.11,14.5 55.85,17.25 55.85,18.92 54.79,19.99 54.63,19.99 R29.2 54.41,20.22 47.47,27.15 45.49,27.15 43.74,28.91 40.08,28.91 38.79,30.2 38.79,30.96 74238.16 | v19.05,19.07 20.95,20.98 20.95,26.09 22.17,27.3 22.17,30.96 74151-1.16 | v7.01,27.61 5.49,29.13 5.3,29.32 | 62.9,21.32 62.26,21.97 62.26,22.73 MCP6004-TRIG.4 | 62.9,21.32 63.86,20.37 65.76,20.37 66.83,21.44 66.83,27.3 68.89,29.36 68.96,29.36 69.8,30.2 C5.1 69.95,30.51 69.95,33.55 71.86,35.46 89.46,35.46 90.22,34.7 90.22,30.51 C3.1 90.22,30.2 91.44,30.2 | C10.1 111.56,25.4 111.56,29.29 111.71,29.44 C8.1 | C8.1 111.33,29.44 110.26,29.44 108.28,31.42 106.68,31.42 C7.1 106.45,31.27 98.53,31.27 96.32,29.06 INVERTOR.14 96.47,28.52 94.79,30.2 91.44,30.2 | MCP4922-2.9 85.11,27.99 85.11,27.15 85.88,26.39 90.45,26.39 91.44,27.38 91.44,29.97 91.44,30.2 | 133.96,9.4 135.64,9.4 135.87,9.17 C12.1 136.09,8.94 136.47,8.56 142.19,8.56 C4.+ | 133.96,9.4 128.78,9.4 U1.18 | R5.2 144.78,30.12 144.55,30.12 143.56,29.13 143.56,20.83 144.02,20.37 JP2.VBUS 143.33,20.68 140.21,17.55 135.94,17.55 C9.1 135.64,17.4 133.96,15.72 133.96,9.63 133.96,9.4 | v134.49,29.67 132.74,31.42 128.32,31.42 C11.1 | v123.83,26.47 123.22,27.08 123.22,27.99 MCP4922.9 | v138.15,25.86 135.94,23.65 135.94,22.81 MCP6004-V.4 | C13.1 74.91,19.3 70.1,19.3 C6.1 69.8,19.3 69.57,19.07 69.57,13.97 R23.2 69.8,13.82 75.06,13.82 75.67,13.21 79.78,13.21 81,14.43 GATE.P$1 81.23,14.66 81.23,19.07 78.79,21.51 78.79,22.5 MCP4922-2.1 78.72,22.81 73.69,27.84 73.69,28.22 R3.2
  Top 0.61: U1.4 120.93,11.84 121.31,11.46 121.31,10.54 121.01,10.24 U1.6 119.94,10.24 119.02,10.24 115.82,13.44 v115.82,17.17 | v115.98,21.89 116.81,22.73 MCP4922.1 | v113.84,29.44 112.01,29.44 C8.1 | v61.27,19.69 62.71,21.13 62.9,21.32
  Bottom 0.61: 19.05,17.25 v19.05,19.07 | 19.05,17.25 20.95,15.34 38.79,15.34 v39.01,15.19 v49.53,15.19 49.76,15.34 56.92,15.34 v61.27,19.69 | v7.01,27.61 7.01,24.64 8.99,22.66 8.99,21.36 14.94,15.42 17.14,15.42 18.82,17.09 19.05,17.25 | 138.34,26.05 144.02,20.37 JP2.VBUS 143.87,20.07 142.72,18.92 142.72,11.68 149.81,4.6 149.81,3.83 ISP1.2 | 138.34,26.05 134.72,29.67 v134.49,29.67 134.26,29.52 131.22,26.47 v123.83,26.47 123.6,26.62 122.76,26.62 116.74,32.64 114.53,32.64 114.07,32.18 114.07,29.44 | v138.15,25.86 138.34,26.05 | GATE.P$1 81.31,14.58 89.53,14.58 90.91,13.21 95.02,13.21 96.24,14.43 GLIDE1.P$1 96.55,14.66 99.06,17.17 v115.82,17.17 115.98,17.4 v115.98,21.89 115.82,22.12 114.07,23.88 114.07,29.44 | v113.84,29.44 114.07,29.44
A0IN  (via drill 0.35)
  Top 0.152: v127.25,14.5 U1.25 | v94.41,20.98 v99.29,16.1 | v31.62,34.62 32.69,33.55 32.69,30.89 31.55,29.74 29.41,29.74 28.57,30.58 28.57,30.96 74151-1.11 28.57,31.04 28.57,31.42 24.77,35.23 21.79,35.23 16.31,29.74 14.17,29.74 13.34,30.58 13.34,30.96 75151-2.11
  Bottom 0.152: v127.25,14.5 125.65,16.1 v99.29,16.1 | v94.41,20.98 71.09,20.98 60.5,31.57 58.06,31.57 55.02,34.62 55.02,34.92 53.95,35.99 32.99,35.99 v31.62,34.62
A0OUT  (via drill 0.35)
  Top 0.152: v121.39,9.32 121.84,9.78 121.84,12.22 120.7,13.36 120.17,13.36 U1.2 | v39.93,23.27 38.79,24.41 38.79,24.87 74238.1
  Bottom 0.152: v121.39,9.32 99.14,9.32 97.61,10.85 71.02,10.85 58.6,23.27 v39.93,23.27
A1IN  (via drill 0.35)
  Top 0.152: v126.26,14.5 126.42,14.66 126.42,15.72 U1.26 | v32.08,33.25 31.24,33.25 29.87,31.88 29.87,31.04 74151-1.10 29.87,31.95 25.98,35.84 18.97,35.84 14.63,31.5 14.63,31.04 75151-2.10
  Bottom 0.152: v126.26,14.5 98.07,14.5 96.85,13.28 95.86,13.28 95.25,12.68 89.31,12.68 88.16,13.82 82.14,13.82 81.76,13.44 75.29,13.44 54.41,34.31 54.41,34.62 53.65,35.38 34.21,35.38 v32.08,33.25
A1OUT  (via drill 0.35)
  Top 0.152: v117.73,7.19 121.61,7.19 U1.9 | v101.27,7.19 97.61,10.85 72.85,10.85 v70.71,12.98 | v41.91,26.39 41.07,26.39 40.01,25.32 74238.2
  Bottom 0.152: v101.27,7.19 v117.73,7.19 | v70.71,12.98 57.3,26.39 v41.91,26.39
A2IN  (via drill 0.35)
  Top 0.152: v124.82,12.06 125.65,12.9 U1.27 | v96.32,11.46 87.48,11.46 v82.07,16.87 | v31.47,32.56 31.47,31.34 31.17,31.04 74151-1.9 | v20.12,35.23 15.93,31.04 75151-2.9
  Bottom 0.152: v124.82,12.06 123.37,12.06 122.76,11.46 v96.32,11.46 | v82.07,16.87 72.31,16.87 54.71,34.47 54.71,34.77 53.8,35.69 33.6,35.69 31.51,33.59 | 31.51,33.59 31.47,33.55 v31.47,32.56 | v20.12,35.23 29.87,35.23 31.47,33.63 31.51,33.59
A2OUT  (via drill 0.35)
  Top 0.152: v120.62,6.58 120.93,6.27 122.07,6.27 122.45,6.65 122.45,7.11 U1.10 | v43.13,12.68 43.13,22.58 41.3,24.41 41.3,24.87 74238.3
  Bottom 0.152: v120.62,6.58 99.82,6.58 99.06,5.82 69.27,5.82 62.41,12.68 v43.13,12.68
BR0
  Top 0.152: R24.2 34.29,20.07 34.29,23.42 31.17,26.54 30.1,26.54 26.59,30.05 26.59,32.18 26.21,32.56 20.65,32.56 15.16,27.08 12.57,27.08 10.82,25.32 10.82,24.87 75151-2.4 10.74,24.87 10.74,24.41 9.91,23.57 9.45,23.57 6.33,20.45 6.33,12.29 7.09,11.53 8.15,11.53 9.3,12.68 10.13,12.68 U$4.4
BR1  (via drill 0.35)
  Top 0.152: v32.46,26.24 38.1,20.6 38.1,20.07 R25.2 | v15.32,16.26 15.32,12.83 15.24,12.75 U$4.8 | v9.53,26.47 75151-2.3
  Bottom 0.152: v32.46,26.24 27.2,20.98 27.2,20.9 25.98,19.69 18.75,19.69 v15.32,16.26 15.32,16.33 9.53,22.12 v9.53,26.47
BR2  (via drill 0.35)
  Top 0.152: R26.2 41.91,20.07 38.41,23.57 38.33,23.57 32.99,28.91 32.99,34.16 28.96,38.2 19.74,38.2 13.79,32.26 9.07,32.26 8.84,32.03 v8.84,28.68 8.84,25.4 8.31,24.87 75151-2.2
  Bottom 0.152: v8.84,28.68 6.71,28.68 6.4,28.37 6.4,21.82 13.87,14.35 13.87,12.37 14.71,11.53 18.29,11.53 19.43,12.68 20.27,12.68 U$4.12
BR3  (via drill 0.35)
  Top 0.152: v43.74,18.01 R27.2 | v27.36,16.18 27.36,14.66 25.45,12.75 U$4.16 | v7.01,22.12 7.01,24.87 75151-2.1
  Bottom 0.152: v43.74,18.01 29.18,18.01 v27.36,16.18 | v7.01,22.12 15.24,13.89 24.23,13.89 25.38,12.75 U$4.16
BR4  (via drill 0.35)
  Top 0.152: v45.34,14.35 45.34,15.19 47.32,17.17 50.37,17.17 50.52,17.32 50.52,18.85 49.53,19.84 R28.2 | v7.7,22.73 7.7,26.01 8.23,26.54 8.23,30.96 75151-2.15
  Bottom 0.152: v45.34,14.35 32.08,14.35 30.48,12.75 U$4.20 30.48,12.83 28.8,14.5 15.09,14.5 7.7,21.89 v7.7,22.73
BUT1
  Top 0.152: 74151-1.13 26.06,30.96 26.06,29.82 29.26,26.62 29.26,21.36 35.81,14.81 35.81,13.97 R8.1 35.89,11.07 36.8,10.16 BUT1.4 36.73,10.16 35.2,8.64 35.2,6.96 36.8,5.36 36.8,5.13 BUT1.3
BUT2  (via drill 0.35)
  Top 0.152: 48.54,13.97 48.54,11.68 47.02,10.16 BUT2.4 47.09,10.16 48.62,8.64 48.62,6.96 47.02,5.36 47.02,5.13 BUT2.3 | 48.54,13.97 R9.1 48.54,13.97 | v40.62,20.45 34.21,26.85 31.01,26.85 27.36,30.51 27.36,30.96 74151-1.12 | v47.09,16.03 47.09,15.42 48.54,13.97
  Bottom 0.152: v40.62,20.45 42.67,20.45 v47.09,16.03
BUT3  (via drill 0.35)
  Top 0.152: R23.1 67.59,13.97 67.59,7.72 63.78,3.91 59.59,3.91 58.45,5.05 BUT3.3 | v34.67,13.74 34.67,15.49 28.96,21.21 27.96,21.21 25.45,23.72 25.45,25.86 25.15,26.16 25.15,29.36 24.77,29.74 24.77,30.96 74151-1.14
  Bottom 0.152: v34.67,13.74 38.33,10.08 38.33,9.93 39.09,9.17 44.58,9.17 46.56,11.15 47.4,11.15 48.54,10.01 48.54,9.86 49.23,9.17 56.77,9.17 | 56.77,9.17 57.38,9.17 58.37,10.16 BUT3.4 | 56.77,9.17 56.77,6.96 58.37,5.36 58.37,5.13 BUT3.3
BUTLED1  (via drill 0.35)
  Top 0.152: v118.42,5.36 122.76,5.36 124.05,6.65 124.05,7.11 U1.12
  Bottom 0.152: v118.42,5.36 67.06,5.36 65.46,3.76 40.54,3.76 39.4,4.9 BUT1.A
BUTLED2  (via drill 0.35)
  Top 0.152: v119.94,5.97 122.53,5.97 123.22,6.65 123.22,7.11 U1.11 | v50.67,3.15 50.67,3.76 49.53,4.9 BUT2.A
  Bottom 0.152: v119.94,5.97 117.12,3.15 v50.67,3.15
BUTLED3  (via drill 0.35)
  Top 0.152: v117.73,4.75 122.91,4.75 124.82,6.65 124.82,7.11 U1.13 | v65.53,4.75 v67.36,4.75
  Bottom 0.152: v67.36,4.75 v117.73,4.75 | v65.53,4.75 64.62,4.75 63.93,4.06 61.8,4.06 60.96,4.9 BUT3.A
CLK_IN  (via drill 0.35)
  Top 0.152: v124.36,19 121.69,16.33 121.69,15.72 U1.32 | v126.8,19 137.69,19 143.03,24.33 143.03,30.2 143.87,31.04 145.69,31.04 145.73,31 | 145.73,31 145.77,30.96 145.77,29.29 144.78,28.3 R5.1 | CLOCK.C 153.62,35.38 153.62,32.56 152.09,31.04 145.77,31.04 145.73,31
  Bottom 0.152: v126.8,19 v124.36,19
CS1
  Top 0.152: 102.68,15.3 96.55,21.44 96.55,22.28 INVERTOR.1 | 102.68,15.3 104.85,13.13 104.85,4.06 106.53,2.39 121.39,2.39 125.65,6.65 125.65,7.11 U1.14 | MCP4922.3 119.33,22.73 119.33,22.28 118.03,20.98 108.36,20.98 102.72,15.34 102.68,15.3
CS2
  Top 0.152: INVERTOR.2 97.77,22.35 97.77,23.27 96.55,24.49 82.45,24.49 81.31,23.34 81.31,22.81 MCP4922-2.3
DAIN  (via drill 0.35)
  Top 0.152: v115.14,19.61 124.66,19.61 128.7,15.57 128.7,14.27 U1.24 | v72.62,17.48 70.48,17.48 v70.41,17.4 | v28.5,26.47 27.36,25.32 27.36,24.87 74151-1.5
  Bottom 0.152: v115.14,19.61 115.14,19.3 113.54,17.7 97.16,17.7 96.62,17.17 82.68,17.17 82.37,17.48 v72.62,17.48 | v70.41,17.4 70.1,17.4 57.84,29.67 31.7,29.67 v28.5,26.47
DBIN  (via drill 0.35)
  Top 0.152: v129.62,17.09 129.62,13.82 129.24,13.44 128.78,13.44 U1.23 | v114.91,31.8 113.23,31.8 106.07,38.96 61.57,38.96 53.8,46.74 31.62,46.74 23.7,38.81 18.97,38.81 v13.34,33.17 | v13.26,26.47 12.12,25.32 12.12,24.87 75151-2.5
  Bottom 0.152: v114.91,31.8 v129.62,17.09 | v13.34,33.17 13.34,26.54 v13.26,26.47
ENOUT1
  Top 0.152: R29.1 54.56,18.16 53.11,18.16 47.7,23.57 45.95,23.57 45.11,24.41 45.11,24.87 74238.6
GND  (via drill 0.35)
  Top 0.61: R7.1 153.69,40.95 154.69,39.95 154.69,33.25 CLOCK.E 154.46,32.94 154.46,27.76 147.07,20.37 | 147.07,20.37 146.07,20.37 JP2.GND | v133.12,11.84 128.78,11.84 U1.21 | C9.2 135.87,15.49 135.87,13.44 134.95,12.52 v134.8,12.29 135.87,11.23 C12.2 136.17,11.07 142.8,11.07 | 147.41,6.46 149.81,8.87 ISP1.6 | 147.41,6.46 145.16,4.22 142.26,4.22 C4.- | 142.8,11.07 147.22,6.65 147.41,6.46 | 147.07,20.37 147.22,20.14 147.22,18.47 147.37,18.31 147.37,15.72 142.95,11.3 142.8,11.07 | 119.33,12.6 119.02,12.29 119.02,11.38 119.33,11.07 119.94,11.07 120.02,11 120.17,11 U1.5 | 119.33,12.6 120.17,12.6 U1.3 | C18.2 106.91,3.83 106.91,8.1 106.68,8.33 106.68,10.01 107.9,11.23 C17.2 107.9,11.53 107.9,12.9 113.16,18.16 | 113.16,18.16 116.05,18.16 116.66,17.55 116.66,15.34 119.18,12.83 119.33,12.6 | MCP6004-V.11 135.87,27.99 135.87,27.15 134.8,26.09 127.79,26.09 125.88,27.99 124.51,27.99 MCP4922.8 124.36,28.3 124.36,29.36 v124.05,29.67 | C10.2 109.42,25.4 109.42,26.7 106.68,29.44 C7.2 | INVERTOR.7 104.17,22.35 104.55,22.35 107.44,25.25 109.19,25.25 C10.2 | CV2.GND 105.46,34.09 106.76,34.09 109.35,31.5 111.71,31.5 C8.2 112.01,31.34 112.93,31.34 114,30.28 114.68,30.28 | 122.95,32.45 121.31,34.09 120.7,34.09 CV1.GND | 122.95,32.45 125.88,29.52 128.25,29.52 C11.2 | 122.95,32.45 122.76,32.26 119.41,28.91 119.41,28.07 MCP4922.12 119.18,29.06 117.96,30.28 114.68,30.28 | C10.2 109.65,25.17 110.34,24.49 110.34,24.41 110.64,24.1 112.32,24.1 114.68,26.47 114.68,30.05 114.68,30.28 | v113,19 113,18.39 113.16,18.16 | 88.85,28.14 86.49,28.14 86.41,28.07 MCP4922-2.8 86.33,28.37 86.33,28.83 85.57,29.59 82.07,29.59 81.31,28.83 81.31,28.07 MCP4922-2.12 81.08,28.98 78.79,31.27 72.62,31.27 72.39,31.27
  Top 0.61: 88.85,28.14 90.14,28.14 C3.2 | CV3.GND 88.85,34.09 88.85,28.37 88.85,28.14 | BUT3.1 63.55,5.13 63.55,9.93 BUT3.2 63.48,10.16 63.25,10.39 63.25,13.97 R14.1 63.4,14.2 63.4,15.04 69.57,21.21 C6.2 | REF.2 92.35,19.23 92.35,15.49 91.52,14.66 GLIDE1.P$3 | C6.2 69.88,21.29 74.91,21.29 C13.2 75.21,21.21 76.2,20.22 76.2,14.66 GATE.P$3 | C6.2 69.88,21.59 69.88,28.14 C5.2 70.1,28.3 72.39,30.58 72.39,31.27 | 72.39,31.27 72.39,34.09 CV4.GND | R1.1 7.62,18.16 10.67,18.16 12.5,19.99 12.65,19.99 R10.1 12.8,20.3 14.48,21.97 14.48,24.64 75151-2.7 14.63,24.87 15.85,24.87 75151-2.8 16,25.09 v18.36,27.46 | C14.2 2.59,28.98 7.62,34.01 7.62,34.09 TRIG4.GND | 26.59,19.99 27.89,19.99 R13.1 | 26.59,19.99 R12.1 | 75151-2.14 9.53,31.04 10.74,31.04 75151-2.13 11.05,31.04 12.04,31.04 75151-2.12 12.19,30.73 12.19,30.12 13.11,29.21 16.54,29.21 21.41,34.09 22.86,34.09 TRIG3.GND | v20.19,29.74 20.19,24.87 17.83,22.5 17.83,20.07 R11.1 | v26.59,21.21 26.59,20.22 26.59,19.99 | MCP6004-TRIG.11 62.18,28.07 62.18,29.59 57.68,34.09 53.34,34.09 TRIG1.GND | 74238.5 42.6,24.87 74238.4 | 74238.8 47.62,25.63 46.86,26.39 44.58,26.39 43.97,25.78 | 43.97,25.78 43.97,25.09 74238.5 | TRIG2.GND 39.32,34.09 39.32,33.63 37.95,32.26 37.95,29.74 40.46,27.23 42.44,27.23 43.74,25.93 43.97,25.78 | 74151-1.7 29.87,24.87 31.09,24.87 74151-1.8 31.24,24.64 31.24,20.98 34.06,18.16 R24.1 34.29,18.09 38.1,18.09 R25.1 38.33,18.09 39.85,18.09 | 39.85,18.09 41.91,18.09 R26.1 | R2.1 56.77,13.97 56.77,13.74 53.19,10.16 52.12,10.16 BUT2.2 52.12,9.93 52.12,5.13 BUT2.1 | R18.1 3.81,2.84 7.62,2.84 R17.1 7.85,2.84 11.43,2.84 R16.1 11.66,2.84 15.24,2.84 R15.1 15.47,2.84 19.05,2.84 R19.1 19.28,2.84 v20.34,2.84
  Top 0.61: 46.94,18.09 45.95,18.09 R27.1 45.72,18.09 44.2,16.56 44.2,13.97 R56.1 43.97,13.74 43.97,12.29 42.06,10.39 BUT1.2 41.91,9.09 | 46.94,18.09 49.53,18.09 R28.1 | 41.91,9.09 41.91,5.13 BUT1.1 41.68,4.9 39.78,3 30.71,3 R22.1 30.48,2.84 26.9,2.84 R21.1 26.67,2.84 22.86,2.84 R20.1 22.63,3 22.33,3.3 v21.57,3.3 | 39.85,18.09 39.85,17.86 39.85,12.52 38.1,10.77 38.1,9.86 38.86,9.09 41.68,9.09 41.91,9.09 | 74238.5 43.81,24.56 43.81,23.95 46.94,20.83 46.94,18.31 46.94,18.09
  Bottom 0.61: 144.78,30.51 144.78,21.59 146,20.37 JP2.GND | 144.78,30.51 144.78,34.09 CLK_IN.GND | v133.12,11.84 134.34,11.84 v134.8,12.29 | 124.05,30.51 124.05,30.73 120.7,34.09 CV1.GND | 124.05,30.51 v124.05,29.67 | v113,19 113,26.54 105.46,34.09 CV2.GND 105.16,34.09 88.92,34.09 CV3.GND | 144.78,30.51 144.55,30.51 124.28,30.51 124.05,30.51 | GLIDE1.P$3 91.44,14.66 90.6,14.66 89.23,16.03 77.65,16.03 76.28,14.66 GATE.P$3 | 20.19,31.42 v20.19,29.74 20.42,29.59 | 20.19,31.42 22.86,34.09 TRIG3.GND | 26.59,26.85 v26.59,21.21 | 26.59,26.85 23.85,29.59 20.42,29.59 | TRIG4.GND 7.62,34.09 17.45,34.09 19.96,31.57 20.19,31.42 | v18.36,27.46 20.27,29.36 20.42,29.59 | TRIG1.GND 53.34,34.09 43.74,34.09 41.68,32.03 40.92,32.03 39.4,33.55 39.4,34.09 TRIG2.GND 39.17,33.4 34.21,33.4 27.81,27 26.82,27 26.59,26.85 | v20.34,2.84 21.11,2.84 v21.57,3.3 | BUT1.2 43.43,11.68 49.91,11.68 51.44,10.16 52.05,10.16 BUT2.2 52.35,10.24 53.65,11.53 61.49,11.53 62.87,10.16 63.48,10.16 BUT3.2
MISO
  Top 0.152: U1.16 127.33,7.11 128.4,7.11 133.43,2.08 150.72,2.08 152.4,3.76 ISP1.1
MK0  (via drill 0.35)
  Top 0.152: U$4.2 7.62,12.75 6.63,13.74 6.63,18.85 7.62,19.84 R1.2 7.62,20.07 9.98,22.43 v10.13,22.43 | v25.76,26.47 25.98,26.24 25.98,24.87 74151-1.4
  Bottom 0.152: v25.76,26.47 14.17,26.47 v10.13,22.43
MK1
  Top 0.152: U$4.6 12.72,12.75 12.72,18.09 R10.2 12.72,18.16 18.97,24.41 18.97,29.44 21.79,32.26 23.93,32.26 24.08,32.11 24.08,29.97 24.77,29.29 74151-1.3
MK2
  Top 0.152: U$4.10 17.83,12.75 17.83,18.09 R11.2 17.91,18.09 18.97,18.09 21.49,20.6 21.49,25.86 21.79,26.16 22.63,26.16 23.47,25.32 23.47,24.87 74151-1.2
MK3
  Top 0.152: U$4.14 22.86,12.75 22.86,18.09 R12.2 22.86,18.16 21.87,19.15 21.87,20.75 22.17,21.06 22.17,24.87 74151-1.1
MK4
  Top 0.152: U$4.18 27.96,12.75 27.96,18.09 R13.2 27.96,18.16 28.96,19.15 28.96,20.75 28.8,20.9 27.81,20.9 26.9,21.82 26.14,21.82 24.16,23.8 24.16,25.93 23.55,26.54 23.55,30.96 74151-1.15
MOSI
  Top 0.152: ISP1.4 149.88,6.35 150.95,5.28 152.4,5.28 153.47,4.22 153.47,3.38 151.87,1.78 131.37,1.78 126.49,6.65 126.49,7.11 U1.15 126.49,6.58 126.34,6.58 121.84,2.08 106.38,2.08 104.55,3.91 104.55,12.6 95.94,21.21 95.94,24.18 | 95.94,24.18 96.39,24.18 97.23,23.34 97.23,21.21 97.46,20.98 107.9,20.98 108.2,21.29 113.54,21.29 116.43,24.18 121.01,24.18 121.92,23.27 MCP4922.5 | 95.94,24.18 84.73,24.18 83.82,23.27 MCP4922-2.5
N$1
  Top 0.152: R14.2 61.27,13.97 61.27,10.69 60.96,10.39 BUT3.K
N$3
  Top 0.152: MCP6004-TRIG.6 65.99,22.81 MCP6004-TRIG.7 | MCP6004-TRIG.6 | MCP6004-TRIG.6 64.77,23.27 61.42,26.62 57.91,26.62 39.4,45.14 39.4,45.59 TRIG2.TIP
N$4
  Top 0.152: MCP6004-TRIG.8 65.99,27.99 MCP6004-TRIG.9 64.77,28.07 64.77,34.16 53.34,45.59 TRIG1.TIP
N$5  (via drill 0.35)
  Top 0.152: MCP6004-TRIG.13 59.66,27.99 58.45,27.99 MCP6004-TRIG.14 58.37,28.07 v58.37,32.18
  Bottom 0.152: v58.37,32.18 58.37,33.63 51.28,40.72 12.5,40.72 7.62,45.59 TRIG4.TIP
N$6  (via drill 0.35)
  Top 0.152: MCP6004-TRIG.2 59.66,22.81 58.45,22.81 MCP6004-TRIG.1 58.37,22.81 57.99,22.81 41.53,39.27 29.18,39.27 v27.13,41.33
  Bottom 0.152: v27.13,41.33 22.86,45.59 TRIG3.TIP
N$7
  Top 0.152: MCP6004-V.8 139.68,27.99 138.46,27.99 MCP6004-V.9 138.38,28.07 138.38,28.52 135.18,31.73 133.2,31.73 120.7,44.22 120.7,45.59 CV1.TIP
N$8
  Top 0.152: R2.2 54.86,13.97 53.11,13.97 49.53,10.39 BUT2.K
N$10
  Top 0.152: U1.7 120.17,9.47 119.02,9.47 114.3,14.2 114.3,14.96 Q2.2 114.3,14.12 109.35,9.17 107.97,9.17 C17.1
N$11
  Top 0.152: U1.8 120.17,8.56 117.5,8.56 114.3,5.36 Q2.1 114.3,5.28 112.85,3.83 108.97,3.83 C18.1
N$17
  Top 0.152: R7.2 153.62,42.85 152.63,41.86 152.63,40.26 152.71,40.18 152.71,33.25 CLOCK.B 152.63,33.25 151.41,32.03 134.72,32.03 133.73,33.02 R6.1
N$25  (via drill 0.35)
  Top 0.152: MCP6004-V.6 138.46,22.81 139.68,22.81 MCP6004-V.7 139.68,22.88 139.68,26.24 140.28,26.85 140.28,29.21 v138.07,31.42
  Bottom 0.152: v138.07,31.42 127.86,31.42 114.76,44.53 73.46,44.53 72.39,45.59 CV4.TIP
N$26
  Top 0.152: R6.2 135.64,33.02 135.64,36.45 144.78,45.59 CLK_IN.TIP
N$31  (via drill 0.35)
  Top 0.152: MCP6004-V.2 132.13,22.81 MCP6004-V.1 132.06,22.81 v125.35,22.81 | v116.36,31.8 115.82,31.8 108.36,39.27 95.25,39.27 88.92,45.59 CV3.TIP
  Bottom 0.152: v116.36,31.8 v125.35,22.81
N$36
  Top 0.152: MCP6004-V.13 132.13,27.99 MCP6004-V.14 132.06,28.07 131.52,28.07 129.01,30.58 125.73,30.58 120.24,36.07 114.99,36.07 105.46,45.59 CV2.TIP
N$65
  Top 0.152: R56.2 42.22,13.97 42.22,13.21 39.4,10.39 BUT1.K
POT1  (via drill 0.35)
  Top 0.152: v126.64,10.24 128.7,10.24 U1.19 | v103.94,10.85 103.48,10.85 100.89,13.44 95.17,13.44 94.03,14.58 GLIDE1.P$2
  Bottom 0.152: v126.64,10.24 104.55,10.24 v103.94,10.85
POT2  (via drill 0.35)
  Top 0.152: v126.26,12.68 128.7,12.68 U1.22 | v87.71,12.9 87.71,13.36 79.4,21.67 79.4,24.26 74.45,29.21 72.85,29.21 72.62,28.98 72.62,25.48 78.72,19.38 78.72,14.66 GATE.P$2
  Bottom 0.152: v126.26,12.68 96.16,12.68 95.56,12.06 88.54,12.06 v87.71,12.9
RST
  Top 0.152: U1.29 124.13,15.72 124.13,11.84 133.58,2.39 144.4,2.39 149.81,7.8 151.33,7.8 152.4,8.87 ISP1.5
SCK  (via drill 0.35)
  Top 0.152: v134.49,8.56 128.78,8.56 U1.17 | v103.94,8.71 100.58,12.06 92.35,12.06 82.6,21.82 82.6,22.73 MCP4922-2.4 | v121.46,20.98 120.7,21.74 120.7,22.73 MCP4922.4
  Bottom 0.152: ISP1.3 151.33,5.28 151.33,3.76 150.34,2.77 149.43,2.77 143.64,8.56 v134.49,8.56 134.34,8.71 127.86,8.71 | 127.86,8.71 v103.94,8.71 | v121.46,20.98 127.33,15.11 127.56,15.11 127.86,14.81 127.86,8.71
T0  (via drill 0.35)
  Top 0.152: v3.81,6.35 3.81,4.83 R18.2 | v30.33,38.2 39.85,38.2 44.42,33.63 44.42,29.9 44.27,29.74 40.84,29.74 40.01,30.58 40.01,30.96 74238.15
  Bottom 0.152: v3.81,6.35 U$4.1 7.54,10.16 5.79,11.91 5.79,36.83 7.16,38.2 v30.33,38.2
T1  (via drill 0.35)
  Top 0.152: v7.62,7.64 7.62,4.83 R17.2 | v41.3,32.87 41.3,31.04 74238.14 | v41.68,34.77 41.22,34.77 39.93,36.07 32.46,36.07 v32.16,36.37
  Bottom 0.152: v7.62,7.64 10.13,10.16 U$4.3 10.06,10.16 8.99,11.23 8.99,13.06 6.1,15.95 6.1,34.16 7.77,35.84 23.09,35.84 23.62,36.37 v32.16,36.37 | v41.3,32.87 41.3,34.39 v41.68,34.77
T2  (via drill 0.35)
  Top 0.152: 16.42,10.65 15.7,11.38 13.95,11.38 12.72,10.16 U$4.5 | 16.42,10.65 16.46,10.62 16.46,4.22 16.08,3.83 14.4,3.83 13.49,4.75 R16.2 | v34.98,27.84 34.98,31.27 38.94,35.23 39.85,35.23 42.52,32.56 42.52,31.04 74238.13 | v21.34,16.18 21.34,15.42 18.97,13.06 18.97,12.22 18.14,11.38 17.14,11.38 16.46,10.69 16.42,10.65
  Bottom 0.152: v34.98,27.84 23.93,16.79 21.95,16.79 v21.34,16.18
T3
  Top 0.152: U$4.7 15.24,8.94 | 15.24,8.94 15.24,4.83 R15.2 | 15.24,8.94 7.16,8.94 6.02,10.08 6.02,25.63 7.62,27.23 7.62,32.11 8.08,32.56 13.64,32.56 19.58,38.51 29.11,38.51 31.85,35.76 39.78,35.76 43.81,31.73 43.81,31.04 74238.12
T4
  Top 0.152: U$4.9 17.83,10.16 19.05,8.94 19.05,4.83 R19.2 19.36,4.75 20.95,3.15 20.95,3 22.02,1.93 50.37,1.93 53.11,4.67 53.11,6.27 57.76,10.92 57.76,22.58 48.08,32.26 45.87,32.26 45.11,31.5 45.11,31.04 74238.11
T5  (via drill 0.35)
  Top 0.152: R20.2 22.86,4.83 22.86,7.64 20.34,10.16 U$4.11 20.42,10.16 21.49,11.23 21.49,13.06 22.25,13.82 v22.25,16.18 | v44.81,29.06 46.33,30.58 46.33,30.96 74238.10
  Bottom 0.152: v44.81,29.06 37.11,29.06 24.23,16.18 v22.25,16.18
T6  (via drill 0.35)
  Top 0.152: R21.2 26.67,4.83 26.67,6.35 U$4.13 22.94,10.16 24.08,11.3 24.08,13.06 26.44,15.42 v26.44,16.18 | v45.49,28.45 47.62,30.58 47.62,30.96 74238.9
  Bottom 0.152: v45.49,28.45 38.71,28.45 v26.44,16.18
T7  (1 unrouted)
  Top 0.152: R22.2 30.48,4.83 30.48,5.13 25.45,10.16 U$4.15
TRIG1  (via drill 0.35)
  Top 0.152: v123.67,17.4 124.82,16.26 124.82,15.72 U1.28 | v117.58,17.4 115.98,19 113.92,19 113.31,19.61 v107.9,19.61 | v65.15,26.01 64.54,26.62 64.39,26.62 63.55,27.46 63.55,27.99 MCP6004-TRIG.10
  Bottom 0.152: v117.58,17.4 v123.67,17.4 | v107.9,19.61 84.2,19.61 83.13,20.68 70.48,20.68 v65.15,26.01
TRIG2  (via drill 0.35)
  Top 0.152: v122.3,13.28 123.22,14.2 123.22,15.72 U1.30 | v65.38,21.21 64.62,21.21 63.55,22.28 63.55,22.73 MCP6004-TRIG.5
  Bottom 0.152: v122.3,13.28 97.31,13.28 97,12.98 96.01,12.98 95.4,12.37 89.15,12.37 88.01,13.51 82.3,13.51 81.92,13.13 73.46,13.13 v65.38,21.21
TRIG3  (via drill 0.35)
  Top 0.152: v122.45,12.06 121.69,12.83 121.69,13.59 122.45,14.35 U1.31 | v61.57,21.21 61.57,22.12 60.96,22.73 MCP6004-TRIG.3
  Bottom 0.152: v122.45,12.06 96.01,12.06 95.71,11.76 71.02,11.76 v61.57,21.21
TRIG4  (via drill 0.35)
  Top 0.152: v119.33,15.11 120.17,14.27 U1.1 | v94.34,19 v98.22,15.11 | v63.78,26.31 62.18,26.31 60.96,27.53 MCP6004-TRIG.12
  Bottom 0.152: v98.22,15.11 v119.33,15.11 | v94.34,19 71.09,19 v63.78,26.31
VOUTA
  Top 0.152: MCP4922.14 116.89,27.99 116.89,27.46 118.8,25.55 135.18,25.55 137.16,27.53 MCP6004-V.10
VOUTB
  Top 0.152: MCP4922.10 121.92,28.07 121.92,28.52 123.67,30.28 124.36,30.28 128.02,26.62 133.73,26.62 134.57,27.46 134.57,27.99 MCP6004-V.12
VOUTC  (via drill 0.35)
  Top 0.152: v112.17,22.28 114.38,24.49 133.43,24.49 134.57,23.34 134.57,22.81 MCP6004-V.3 | v104.7,25.25 81,25.25 78.79,27.46 78.79,27.99 MCP4922-2.14
  Bottom 0.152: v112.17,22.28 107.67,22.28 v104.7,25.25
VOUTD  (via drill 0.35)
  Top 0.152: v108.66,20.37 135.25,20.37 137.16,22.28 137.16,22.73 MCP6004-V.5 | v103.17,25.86 85.5,25.86 83.82,27.53 MCP4922-2.10
  Bottom 0.152: v103.17,25.86 v108.66,20.37

### Text on the board
bNames: Pure Keys / Dev Board / PCB 3 SMD / GMSN! and / Andy C | KeyBoard / Controller